# EAGLE design Mainboard (EAGLE 6.6.0)

## Sheet 1 of 3: Avionics
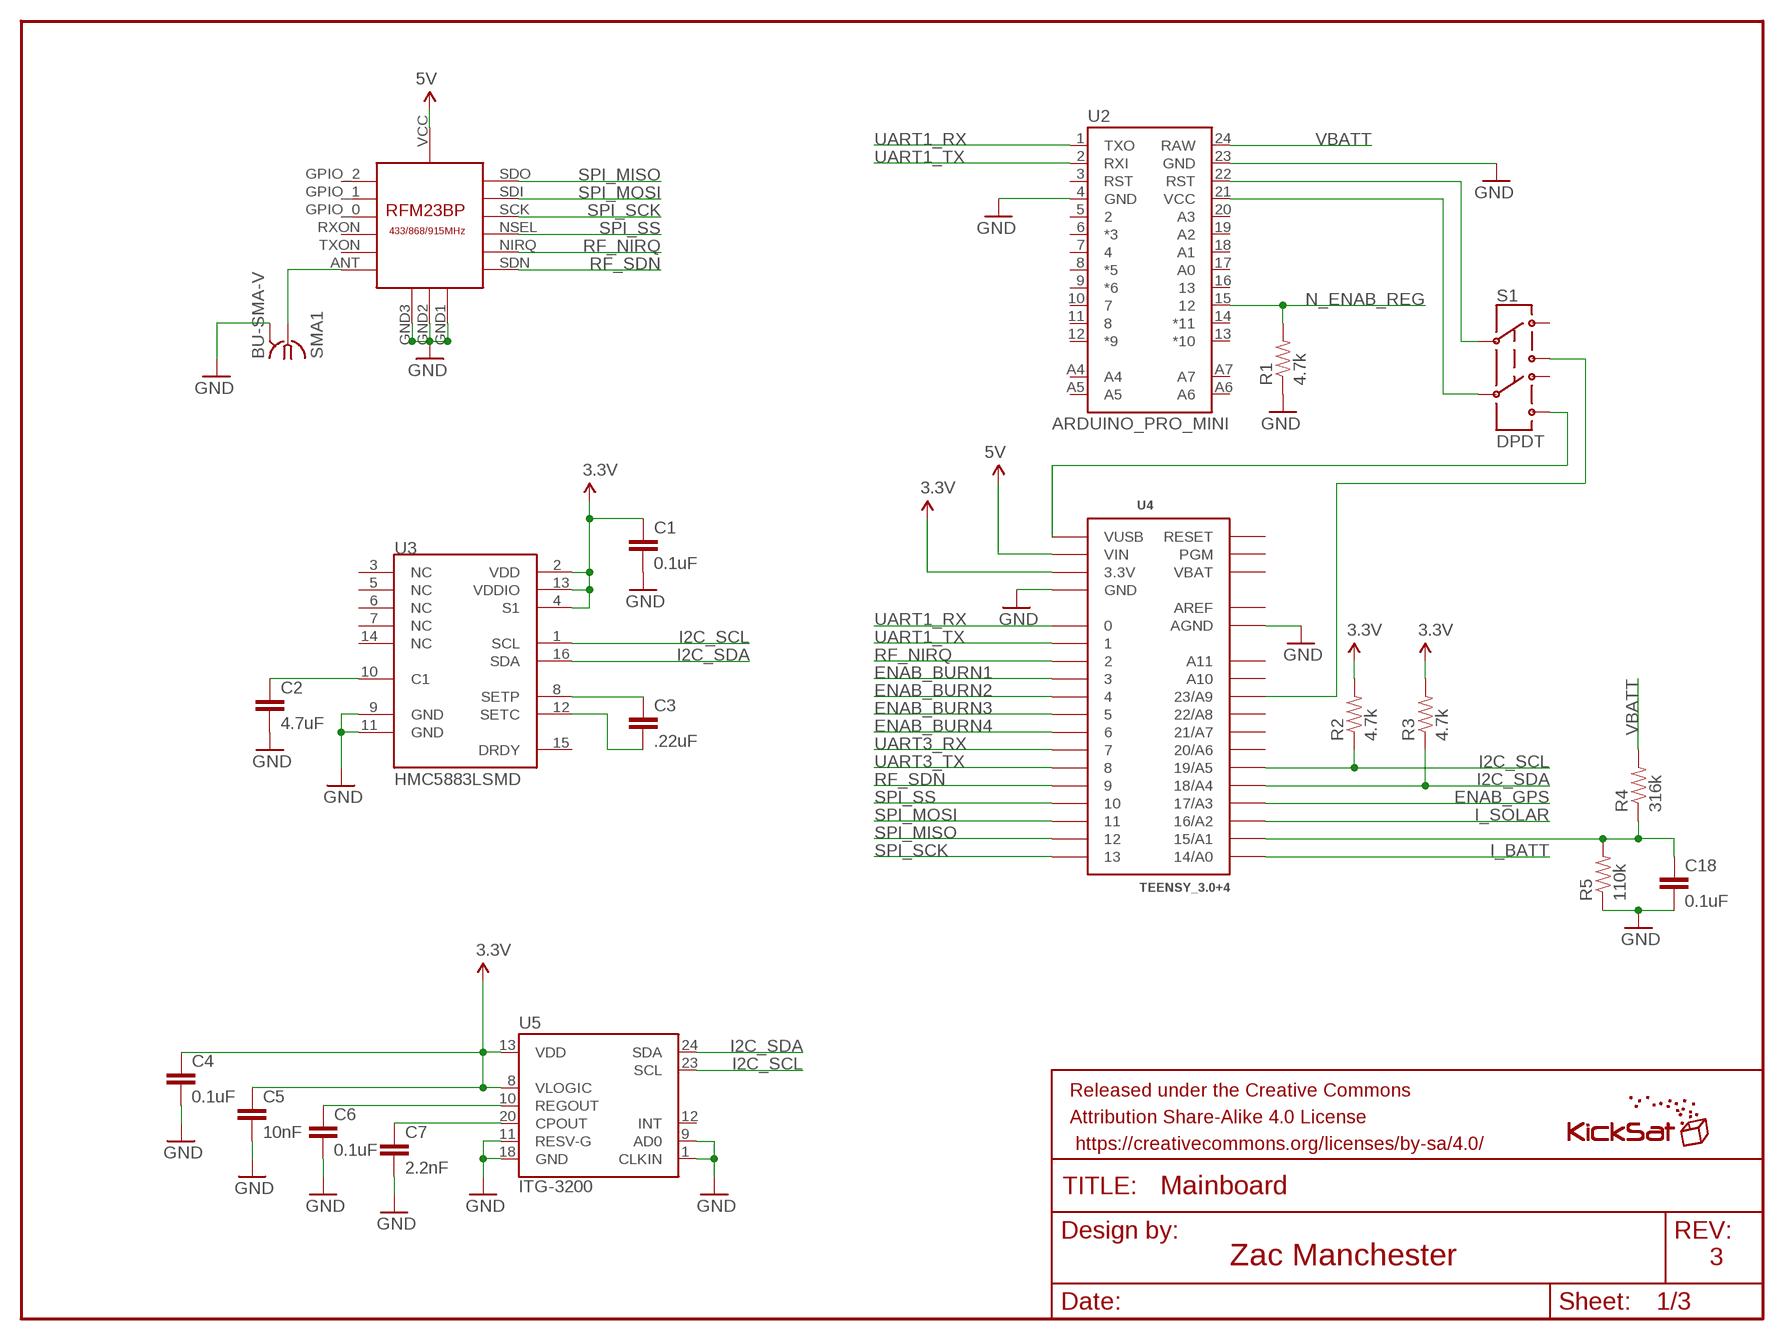
[diagram p0: schematic, sheet 1]

### Parts
C1  0.1uF  CAP0805  [0805]
C2  4.7uF  CAP0805  [0805]
C3  .22uF  CAP0805  [0805]
C4  0.1uF  CAP0805  [0805]
C5  10nF  CAP0805  [0805]
C6  0.1uF  CAP0805  [0805]
C7  2.2nF  CAP0805  [0805]
C18  0.1uF  CAP0805  [0805]
FRAME1  FRAME-LETTER  [CREATIVE_COMMONS]
R1  4.7k  RESISTOR0805-RES  [0805]
R2  4.7k  RESISTOR0805-RES  [0805]
R3  4.7k  RESISTOR0805-RES  [0805]
R4  316k  RESISTOR0805-RES  [0805]
R5  110k  RESISTOR0805-RES  [0805]
S1  DPDT  SWITCH-DPDTAYZ0202  [AYZ0202]
SMA1  BU-SMA-V  [BU-SMA-V]
U1  RFM23BP  [RFM23BP]
U2  ARDUINO_PRO_MINI  [ARDUINO_PRO_MINI]
U3  HMC5883LSMD  [16LPCC]
U4  TEENSY_3.0+4  [TEENSY_3.0+4]
U5  ITG-3200  [QFN-24]
U$3  KICKSAT_LOGO  [KICKSAT_LOGO]

### Nets
3.3V: C1.1 C4.1 C5.1 R2.2 R3.2 U3.2(VDD) U3.4(S1) U3.13(VDDIO) U4.3.3V U4.3.3V1(3.3V) U5.8(VLOGIC) U5.13(VDD) ; also sheet 2
5V: U1.VCC U4.VIN ; also sheet 2
ENAB_BURN1: U4.3 ; also sheet 2
ENAB_BURN2: U4.4 ; also sheet 2
ENAB_BURN3: U4.5 ; also sheet 2
ENAB_BURN4: U4.6 ; also sheet 2
ENAB_GPS: U4.17/A3 ; also sheet 2
GND: C1.2 C2.2 C4.2 C5.2 C6.2 C7.2 C18.2 R1.1 R5.1 SMA1.2 SMA1.3 SMA1.4 SMA1.5 U1.GND1 U1.GND2 U1.GND3 U2.4(GND) U2.23(GND) U3.9(GND) U3.11(GND) U4.AGND U4.GND U4.GND1(GND) U5.1(CLKIN) U5.9(AD0) U5.11(RESV-G) U5.18(GND) ; also sheet 2,3
I2C_SCL: R2.1 U3.1(SCL) U4.19/A5 U5.23(SCL)
I2C_SDA: R3.1 U3.16(SDA) U4.18/A4 U5.24(SDA)
I_BATT: U4.14/A0 ; also sheet 2
I_SOLAR: U4.16/A2 ; also sheet 2
N$11: S1.3 U4.23/A9
N$13: S1.6 U4.VUSB
N$19: SMA1.1 U1.ANT
N$37: C18.1 R4.1 R5.2 U4.15/A1
N$39: C7.1 U5.20(CPOUT)
N$40: C6.1 U5.10(REGOUT)
N$42: C2.1 U3.10(C1)
N$43: C3.1 U3.8(SETP)
N$44: C3.2 U3.12(SETC)
N_ENAB_REG: R1.2 U2.15 ; also sheet 2
PGM_RST: S1.2 U2.22(RST)
PGM_VCC: S1.5 U2.21(VCC)
RF_NIRQ: U1.NIRQ U4.2
RF_SDN: U1.SDN U4.9
SPI_MISO: U1.SDO U4.12
SPI_MOSI: U1.SDI U4.11
SPI_SCK: U1.SCK U4.13
SPI_SS: U1.NSEL U4.10
UART1_RX: U2.1(TXO) U4.0
UART1_TX: U2.2(RXI) U4.1
UART3_RX: U4.7 ; also sheet 3
UART3_TX: U4.8 ; also sheet 3
VBATT: R4.2 U2.24(RAW) ; also sheet 2,3
Unconnected: S1.1 S1.4 U1.GPIO_0 U1.GPIO_1 U1.GPIO_2 U1.RXON U1.TXON U2.3(RST) U2.5 U2.6(*3) U2.7 U2.8(*5) U2.9(*6) U2.10 U2.11 U2.12(*9) U2.13(*10) U2.14(*11) U2.16 U2.17(A0) U2.18(A1) U2.19(A2) U2.20(A3) U2.A4 U2.A5 U2.A6 U2.A7 U3.3(NC) U3.5(NC) U3.6(NC) U3.7(NC) U3.14(NC) U3.15(DRDY) U4.20/A6 U4.21/A7 U4.22/A8 U4.A10 U4.A11 U4.PGM U4.RESET U5.12(INT)

### Notes on the sheet
- Zac Manchester | 3

## Sheet 2 of 3: Power
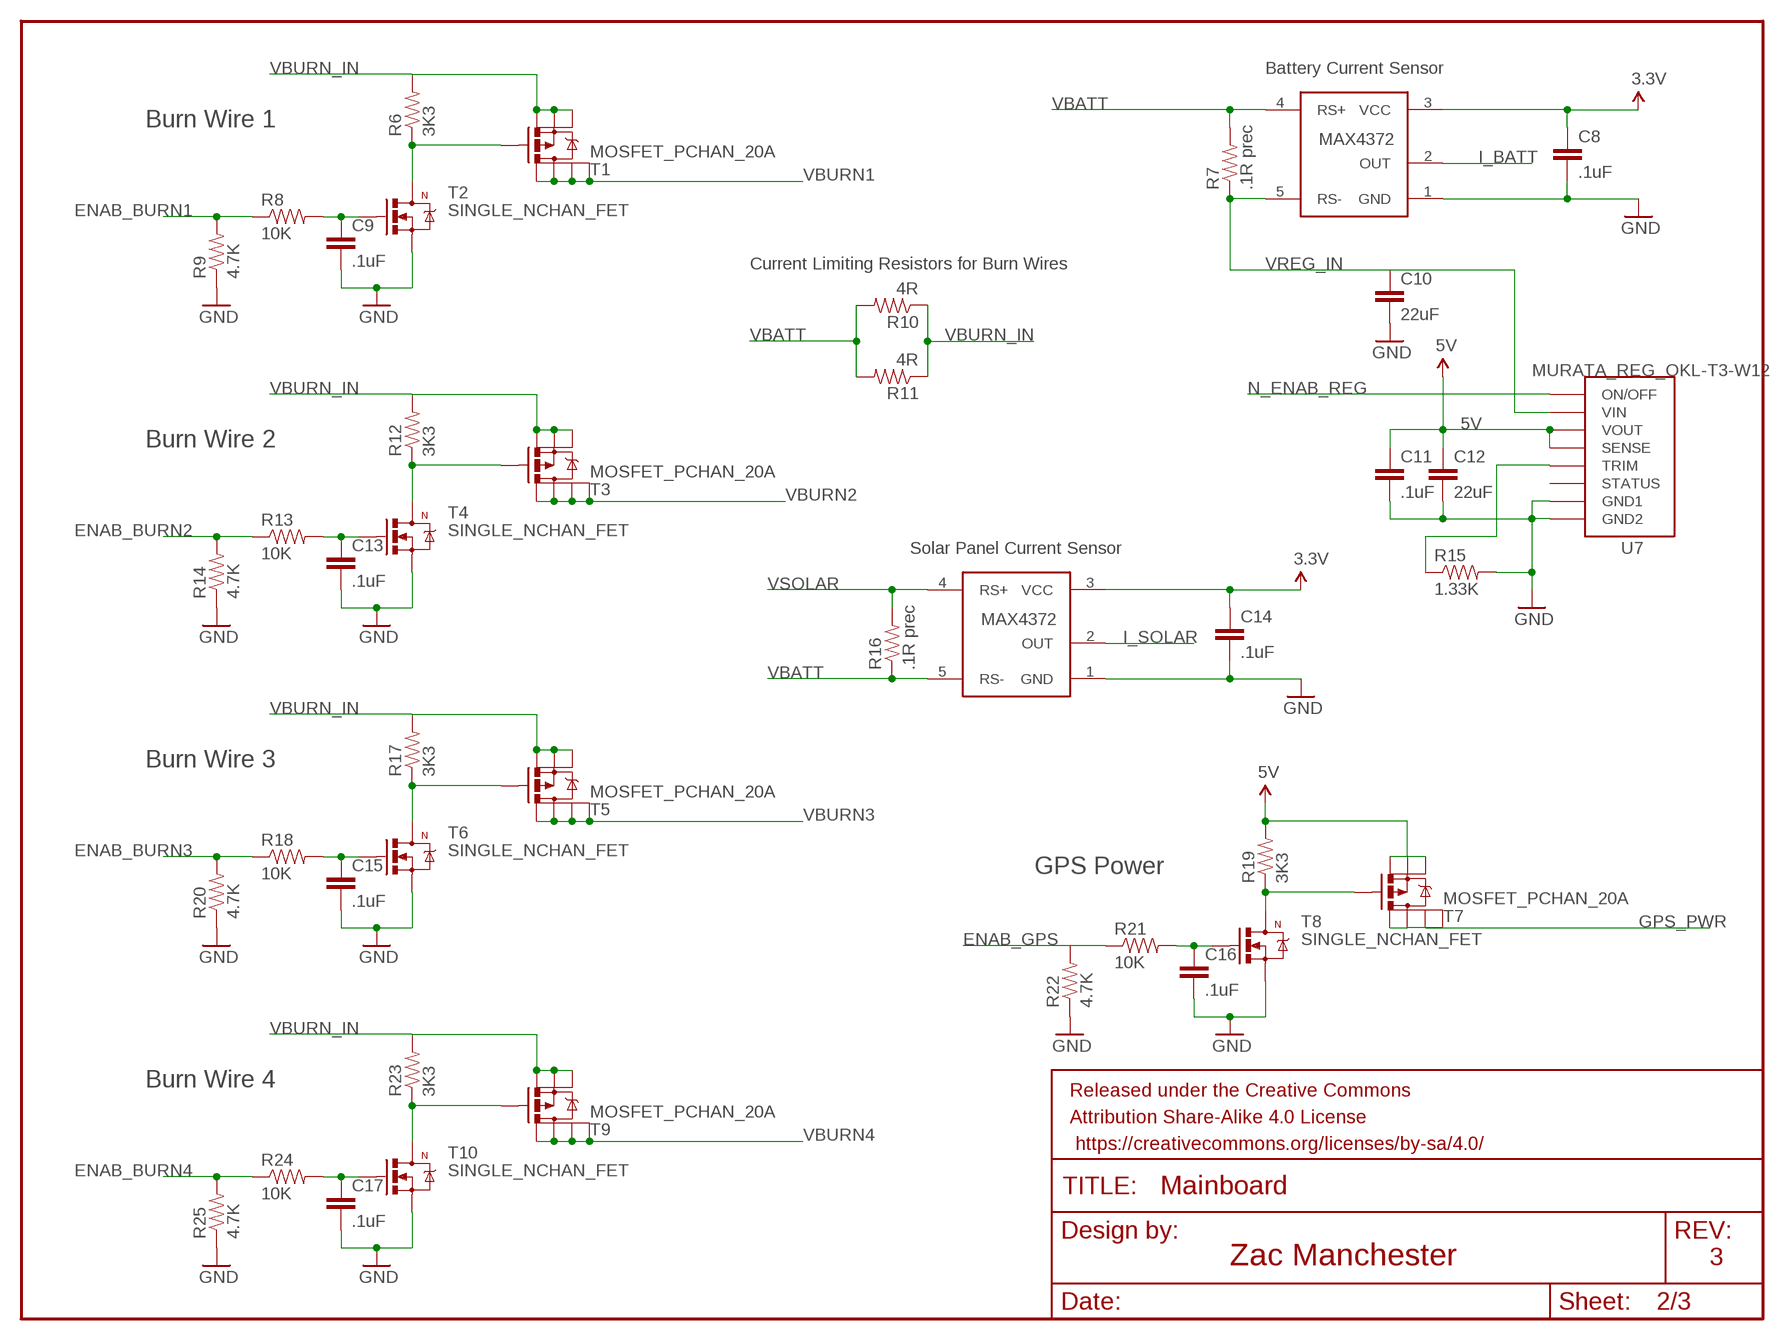
[diagram p1: schematic, sheet 2]

### Parts
C8  .1uF  CAP0805  [0805]
C9  .1uF  CAP0805  [0805]
C10  22uF  CAP1206  [1206]
C11  .1uF  CAP0805  [0805]
C12  22uF  CAP1206  [1206]
C13  .1uF  CAP0805  [0805]
C14  .1uF  CAP0805  [0805]
C15  .1uF  CAP0805  [0805]
C16  .1uF  CAP0805  [0805]
C17  .1uF  CAP0805  [0805]
FRAME2  FRAME-LETTER  [CREATIVE_COMMONS]
R6  3K3  RESISTOR0805-RES  [0805]
R7  .1R prec  RESISTOR0805-RES  [0805]
R8  10K  RESISTOR0805-RES  [0805]
R9  4.7K  RESISTOR0805-RES  [0805]
R10  4R  RESISTOR2512  [R2512]
R11  4R  RESISTOR2512  [R2512]
R12  3K3  RESISTOR0805-RES  [0805]
R13  10K  RESISTOR0805-RES  [0805]
R14  4.7K  RESISTOR0805-RES  [0805]
R15  1.33K  RESISTOR0805-RES  [0805]
R16  .1R prec  RESISTOR0805-RES  [0805]
R17  3K3  RESISTOR0805-RES  [0805]
R18  10K  RESISTOR0805-RES  [0805]
R19  3K3  RESISTOR0805-RES  [0805]
R20  4.7K  RESISTOR0805-RES  [0805]
R21  10K  RESISTOR0805-RES  [0805]
R22  4.7K  RESISTOR0805-RES  [0805]
R23  3K3  RESISTOR0805-RES  [0805]
R24  10K  RESISTOR0805-RES  [0805]
R25  4.7K  RESISTOR0805-RES  [0805]
T1  MOSFET_PCHAN_20A  [SO8]
T2  SINGLE_NCHAN_FET  [SOT23-3]
T3  MOSFET_PCHAN_20A  [SO8]
T4  SINGLE_NCHAN_FET  [SOT23-3]
T5  MOSFET_PCHAN_20A  [SO8]
T6  SINGLE_NCHAN_FET  [SOT23-3]
T7  MOSFET_PCHAN_20A  [SO8]
T8  SINGLE_NCHAN_FET  [SOT23-3]
T9  MOSFET_PCHAN_20A  [SO8]
T10  SINGLE_NCHAN_FET  [SOT23-3]
U6  CURRENT_MAX4372  [SOT23-5]
U7  MURATA_REG_OKL-T3-W12  MURATA_REG_OKL-T6-W12  [MURATA_REG_OKL-T6-W12]
U8  CURRENT_MAX4372  [SOT23-5]

### Nets
3.3V: C8.1 C14.1 U6.3(VCC) U8.3(VCC) ; also sheet 1
5V: C11.1 C12.1 R19.2 T7.1(S) T7.2(S) T7.3(S) U7.4(VOUT) U7.5(SENSE) ; also sheet 1
ENAB_BURN1: R8.1 R9.2 ; also sheet 1
ENAB_BURN2: R13.1 R14.2 ; also sheet 1
ENAB_BURN3: R18.1 R20.2 ; also sheet 1
ENAB_BURN4: R24.1 R25.2 ; also sheet 1
ENAB_GPS: R21.1 R22.2 ; also sheet 1
GND: C8.2 C9.2 C10.2 C11.2 C12.2 C13.2 C14.2 C15.2 C16.2 C17.2 R9.1 R14.1 R15.2 R20.1 R22.1 R25.1 T2.2(S) T4.2(S) T6.2(S) T8.2(S) T10.2(S) U6.1(GND) U7.3(GND1) U7.7(GND2) U8.1(GND) ; also sheet 1,3
GPS_PWR: T7.5(D) T7.6(D) T7.7(D) T7.8(D) ; also sheet 3
I_BATT: U6.2(OUT) ; also sheet 1
I_SOLAR: U8.2(OUT) ; also sheet 1
N$2: C13.1 R13.2 T4.1(G)
N$3: R12.1 T3.4(G) T4.3(D)
N$5: C15.1 R18.2 T6.1(G)
N$6: R17.1 T5.4(G) T6.3(D)
N$7: R15.1 U7.6(TRIM)
N$8: C17.1 R24.2 T10.1(G)
N$9: R23.1 T9.4(G) T10.3(D)
N$10: C16.1 R21.2 T8.1(G)
N$12: R19.1 T7.4(G) T8.3(D)
N$21: C9.1 R8.2 T2.1(G)
N$24: R6.1 T1.4(G) T2.3(D)
N_ENAB_REG: U7.1(ON/OFF) ; also sheet 1
VBATT: R7.2 R10.2 R11.2 R16.1 U6.4(RS+) U8.5(RS-) ; also sheet 1,3
VBURN1: T1.5(D) T1.6(D) T1.7(D) T1.8(D) ; also sheet 3
VBURN2: T3.5(D) T3.6(D) T3.7(D) T3.8(D) ; also sheet 3
VBURN3: T5.5(D) T5.6(D) T5.7(D) T5.8(D) ; also sheet 3
VBURN4: T9.5(D) T9.6(D) T9.7(D) T9.8(D) ; also sheet 3
VBURN_IN: R6.2 R10.1 R11.1 R12.2 R17.2 R23.2 T1.1(S) T1.2(S) T1.3(S) T3.1(S) T3.2(S) T3.3(S) T5.1(S) T5.2(S) T5.3(S) T9.1(S) T9.2(S) T9.3(S)
VREG_IN: C10.1 R7.1 U6.5(RS-) U7.2(VIN)
VSOLAR: R16.2 U8.4(RS+) ; also sheet 3
Unconnected: U7.10(STATUS)

### Notes on the sheet
- Battery Current Sensor
- Burn Wire 1
- Current Limiting Resistors for Burn Wires
- Burn Wire 2
- Solar Panel Current Sensor
- Burn Wire 3
- GPS Power
- Burn Wire 4
- Zac Manchester | 3

## Sheet 3 of 3: Connectors
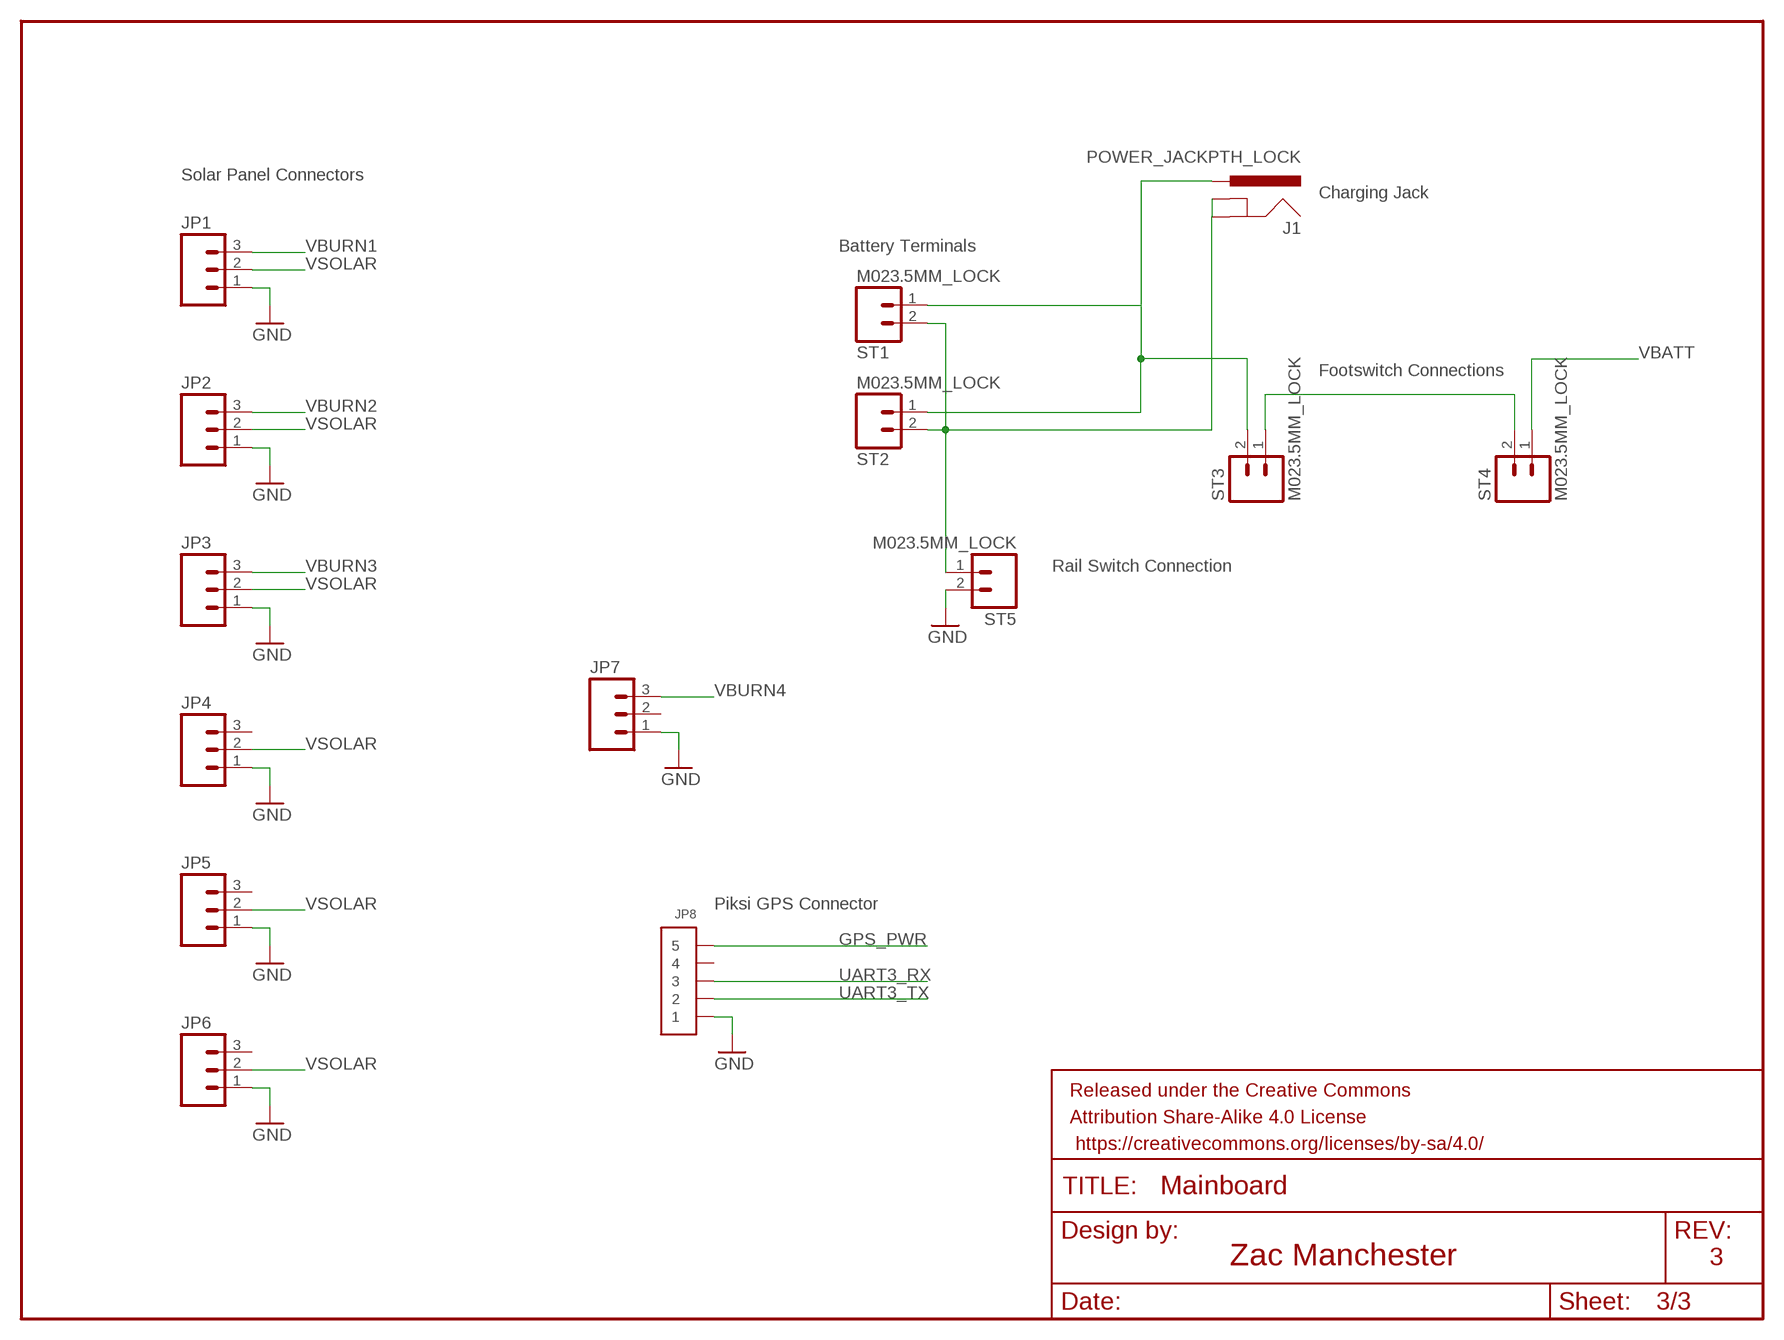
[diagram p2: schematic, sheet 3]

### Parts
FRAME3  FRAME-LETTER  [CREATIVE_COMMONS]
J1  POWER_JACKPTH_LOCK  [POWER_JACK_PTH_LOCK]
JP1  M03POLAR_LOCK  [MOLEX-1X3_LOCK]
JP2  M03POLAR_LOCK  [MOLEX-1X3_LOCK]
JP3  M03POLAR_LOCK  [MOLEX-1X3_LOCK]
JP4  M03POLAR_LOCK  [MOLEX-1X3_LOCK]
JP5  M03POLAR_LOCK  [MOLEX-1X3_LOCK]
JP6  M03POLAR_LOCK  [MOLEX-1X3_LOCK]
JP7  M03POLAR_LOCK  [MOLEX-1X3_LOCK]
JP8  CONN_5-1-53261  [PB-53261-05]
ST1  M023.5MM_LOCK  [SCREWTERMINAL-3.5MM-2_LOCK]
ST2  M023.5MM_LOCK  [SCREWTERMINAL-3.5MM-2_LOCK]
ST3  M023.5MM_LOCK  [SCREWTERMINAL-3.5MM-2_LOCK]
ST4  M023.5MM_LOCK  [SCREWTERMINAL-3.5MM-2_LOCK]
ST5  M023.5MM_LOCK  [SCREWTERMINAL-3.5MM-2_LOCK]

### Nets
BATT_INPUT: J1.PWR ST1.1 ST2.1 ST3.2
GND: JP1.1 JP2.1 JP3.1 JP4.1 JP5.1 JP6.1 JP7.1 JP8.1 ST5.2 ; also sheet 1,2
GPS_PWR: JP8.5 ; also sheet 2
N$1: J1.GND J1.GNDBREAK ST1.2 ST2.2 ST5.1
N$4: ST3.1 ST4.2
UART3_RX: JP8.3 ; also sheet 1
UART3_TX: JP8.2 ; also sheet 1
VBATT: ST4.1 ; also sheet 1,2
VBURN1: JP1.3 ; also sheet 2
VBURN2: JP2.3 ; also sheet 2
VBURN3: JP3.3 ; also sheet 2
VBURN4: JP7.3 ; also sheet 2
VSOLAR: JP1.2 JP2.2 JP3.2 JP4.2 JP5.2 JP6.2 ; also sheet 2
Unconnected: JP4.3 JP5.3 JP6.3 JP7.2 JP8.4

### Notes on the sheet
- Solar Panel Connectors
- Charging Jack
- Battery Terminals
- Footswitch Connections
- Rail Switch Connection
- Piksi GPS Connector
- Zac Manchester | 3

## Power pins joined to a net without a drawn wire
AREF: U4.AREF
VBAT: U4.VBAT

## Library data of the parts
C1-C18 = SparkFun-Capacitors:CAP: Capacitor Standard 0603 ceramic capacitor, and 0.1" leaded capacitor.
FRAME1-FRAME3 = SparkFun-Aesthetics:FRAME-LETTER: Schematic Frame Standard 8.5x11 US Letter frame
J1 = SparkFun-Connectors:POWER_JACK: Power Jack This is the standard 5.5mm barrel jack for power. The PTH is the most common, proven, reliable, footprint. The Slot footprint only works if the mill layer is transmitted to the PCB fab house so be warned. Mating wall wart : TOL-00298 (and others); PROD_ID: PRT-00119
JP1-JP7 = SparkFun-Connectors:M03: Header 3 Standard 3-pin 0.1" header. Use with straight break away headers (SKU : PRT-00116), right angle break away headers (PRT-00553), swiss pins (PRT-00743), machine pins (PRT-00117), and female headers (PRT-00115). Molex polarized connector foot print use with SKU : PRT-08232 with associated crimp pins and housings.
JP8 = pel_molex:CONN_5-1
R1-R25 = SparkFun-Resistors:RESISTOR: Resistor Basic schematic elements and footprints for 0603, 1206, and PTH resistors.
S1 = SparkFun-Electromechanical:SWITCH-DPDT: DPDT Version of the COM-00597; PROD_ID: SWCH-08179
SMA1 = con-coax:BU-SMA-V: FEMALE SMA CONNECTOR Radiall distributor RS 112-3794; OC_FARNELL: unknown; OC_NEWARK: unknown
ST1-ST5 = SparkFun-Connectors:M02: Standard 2-pin 0.1" header. Use with - straight break away headers ( PRT-00116) - right angle break away headers (PRT-00553) - swiss pins (PRT-00743) - machine pins (PRT-00117) - female headers (PRT-00115) Molex polarized connector foot print use with: PRT-08233 with associated crimp pins and housings. 2.54_SCREWTERM for use with PRT-10571. 3.5mm Screw Terminal footprints for PRT-08084 5mm Screw Terminal footprints for use with PRT-08433
T1 T3 T5 T7 T9 = phonesat:MOSFET_PCHAN_20A
T2 T4 T6 T8 T10 = phonesat:SINGLE_NCHAN_FET
U1 = RFM23BP:RFM23BP: HopeRF RFM23BP Library by: http://projects.weber-itam.de
U2 = SparkFun-Boards:ARDUINO_PRO_MINI
U3 = SparkFun-Sensors:HMC5883L: 3 Axis Digital Compass IC
U4 = Teensy3.0:TEENSY_3.0+4: Teensy 3.0 board, showing all pins that are easily acessible. See 'AllAnalogPins" and 'AllPins' packages for additional pin holes, as needed. The 'Basic' package has fewer pins.
U5 = SparkFun-Sensors:ITG-3200: ITG-3200 3-axis gyro, digital output, qfn24 package
U6 U8 = phonesat:CURRENT_MAX4372
U7 = phonesat:MURATA_REG_OKL-T6-W12
U$3 = KickSat-Logo:KICKSAT_LOGO

## Board
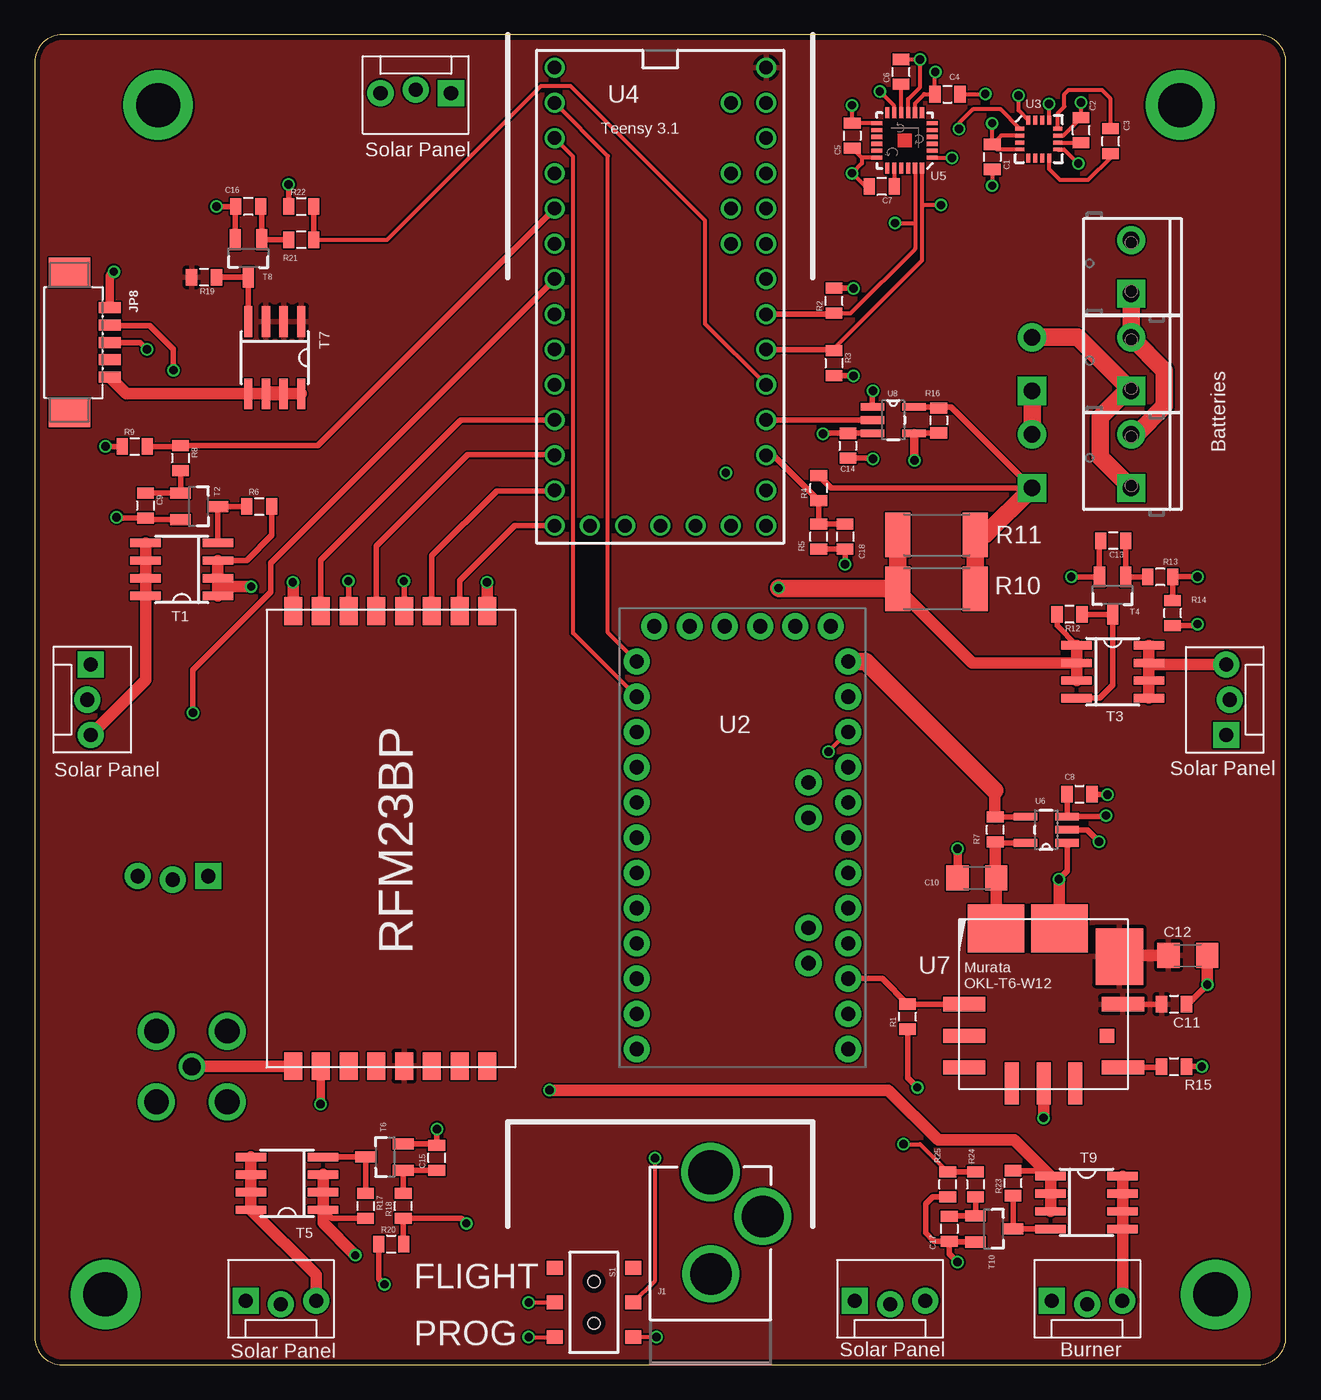
[diagram p3: board, top side]
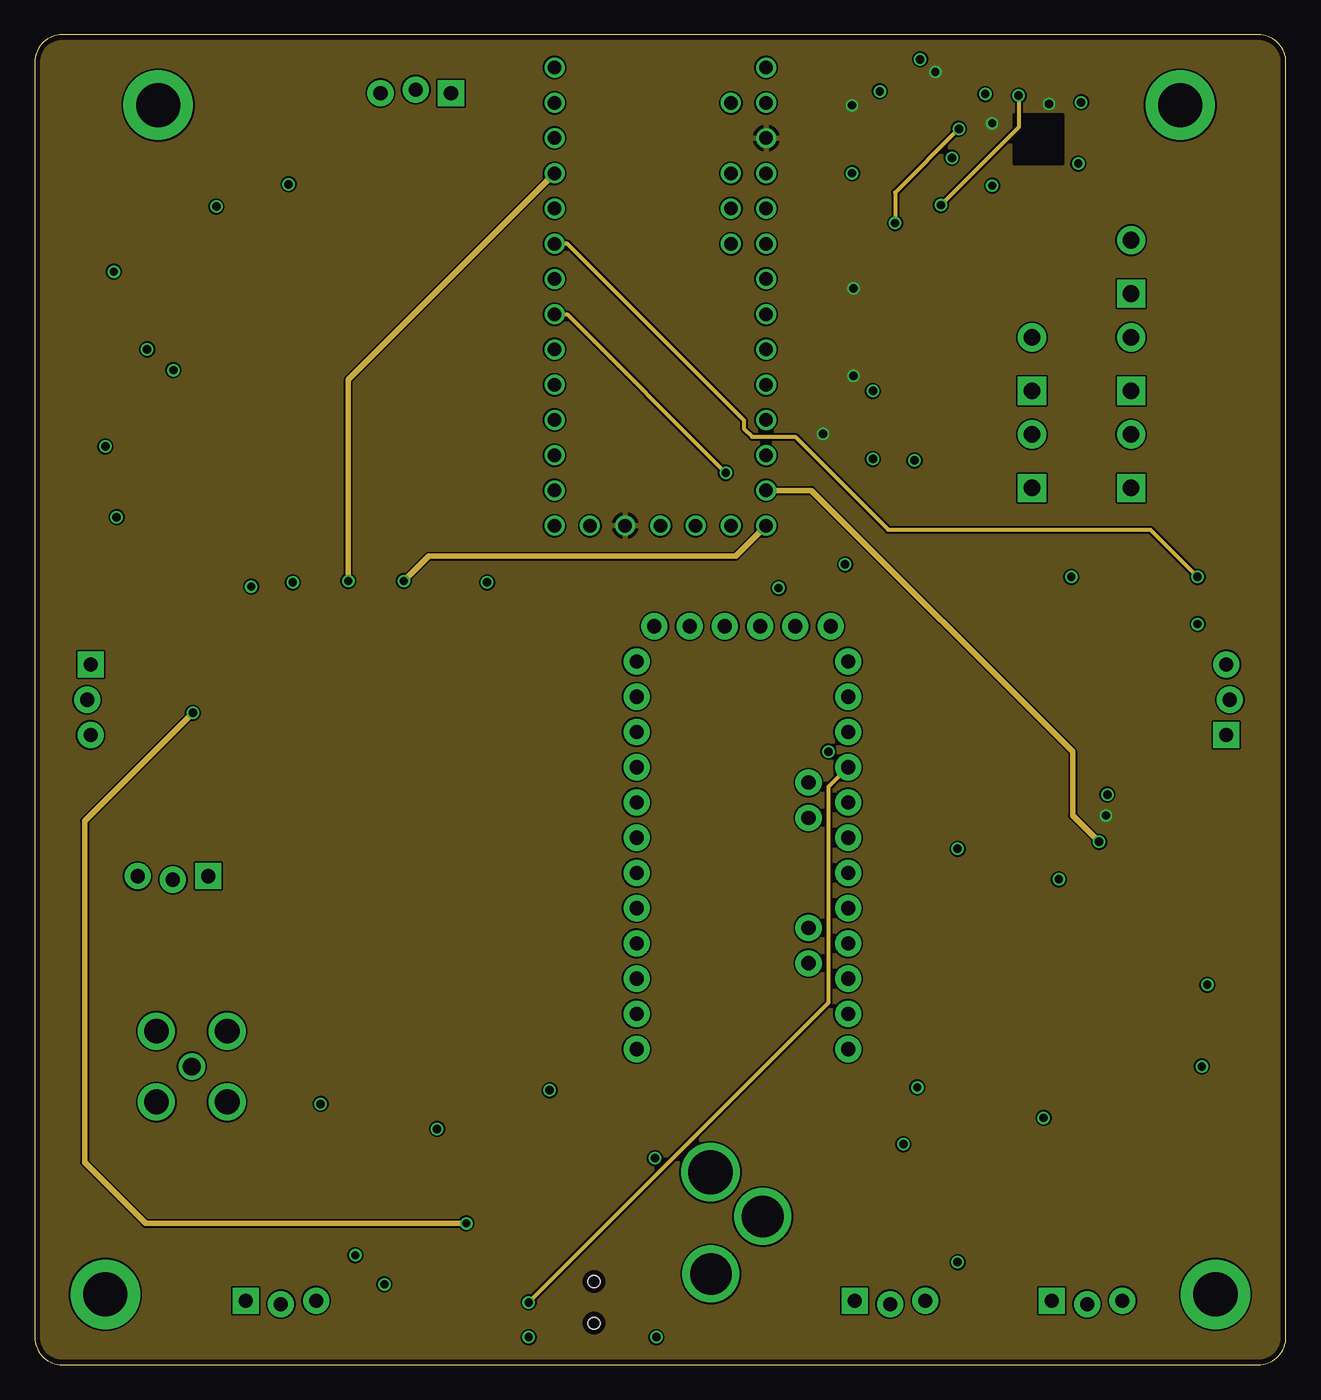
[diagram p4: board, inner layer Route2]
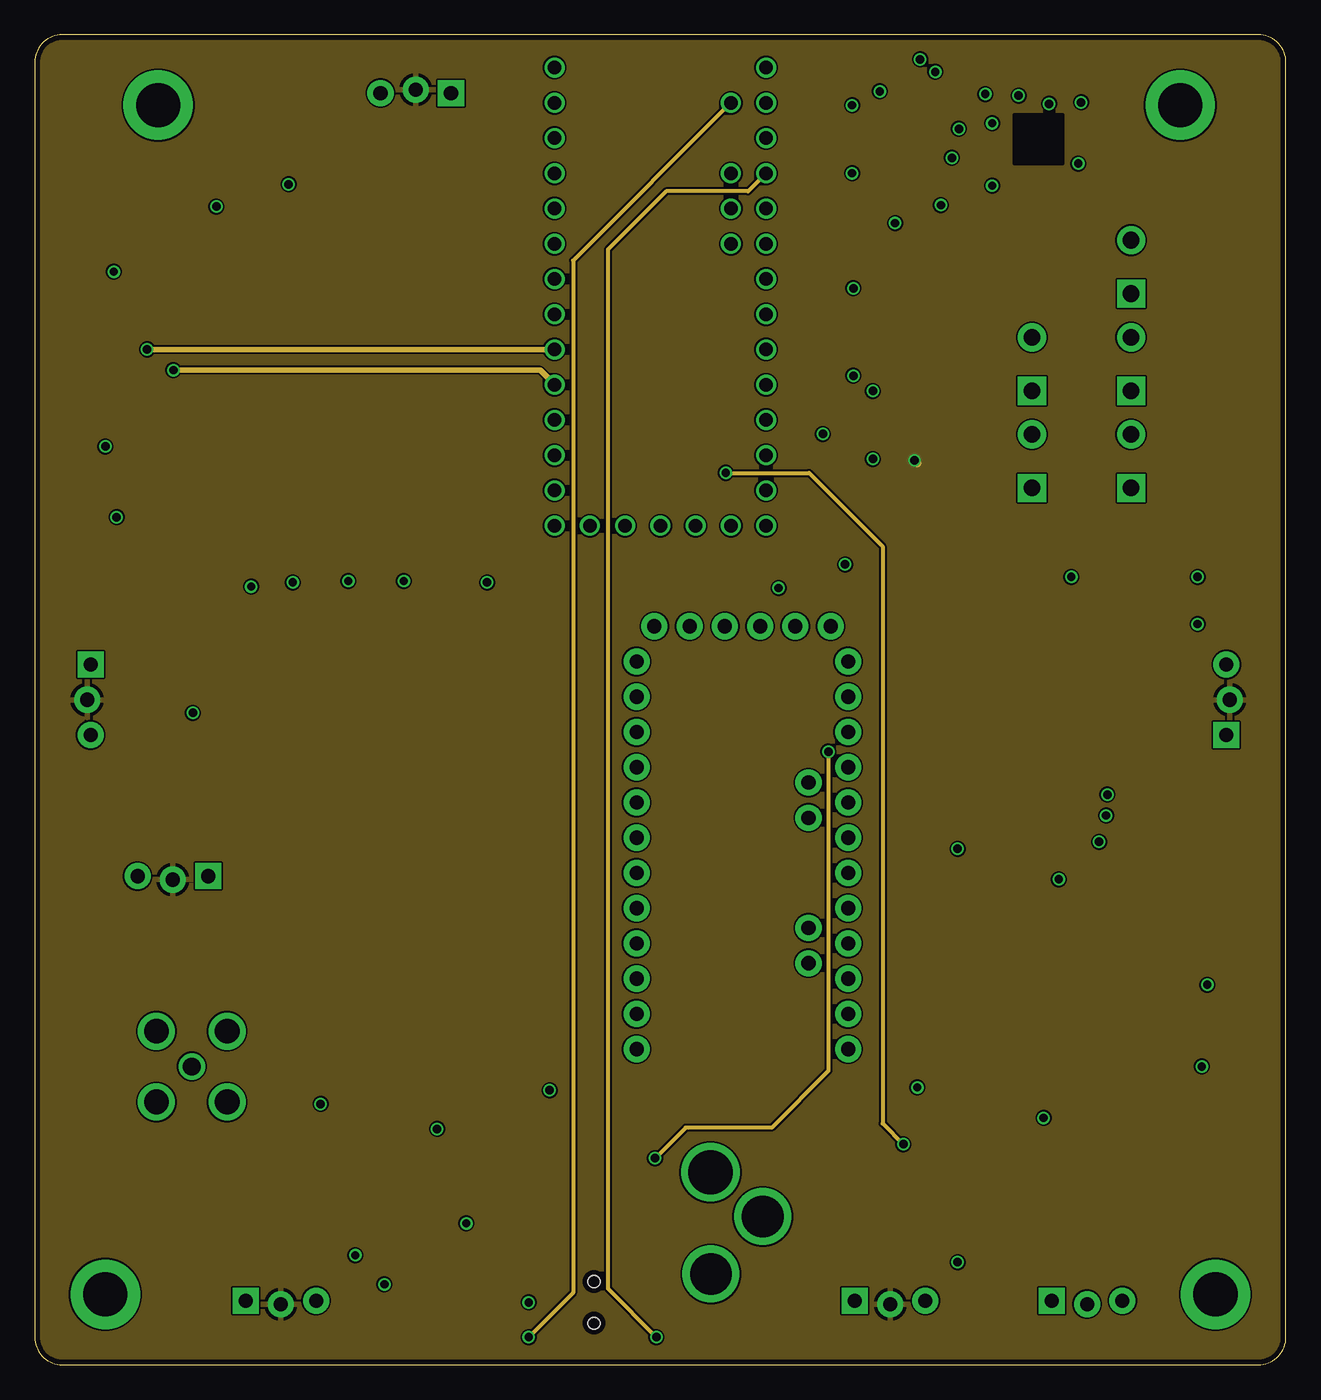
[diagram p5: board, inner layer Route15]
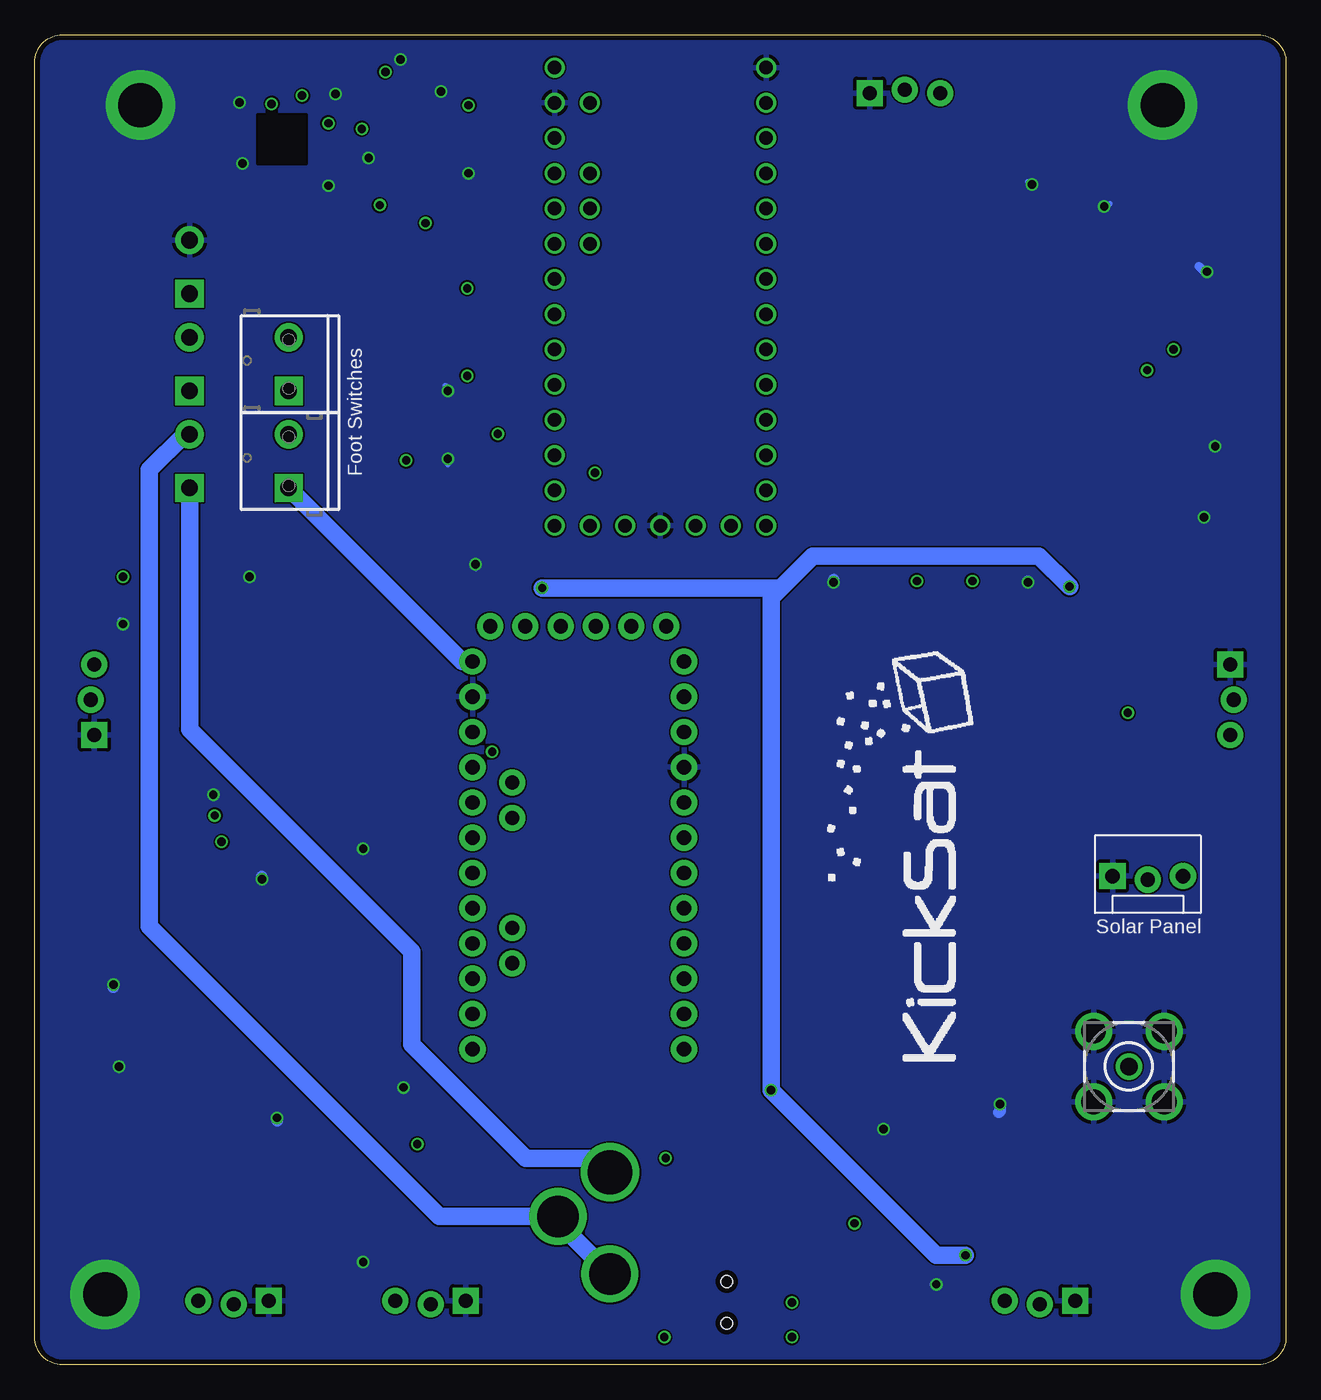
[diagram p6: board, bottom side, seen from below]

Size 90.17 x 95.89 mm. Coordinates in mm from the lower left corner, seen from the top.
Outline: 0,93.89 0,2 arc90 2,0 88.17,0 arc90 90.17,2 90.17,93.89 arc90 88.17,95.89 2,95.89 arc90 0,93.89
Copper layers (1*2*15*16): Top 0.035559375mm / dielectric 0.17018125mm / Route2 0.01778125mm / dielectric 47mil / Route15 0.01778125mm / dielectric 0.17018125mm / Bottom 0.035559375mm
Design rules "OSHPark-4layer": minimum track width 5mil, minimum drill 10mil, track to track 5mil, track to pad 5mil, pad to pad 5mil, via to via 5mil, smd to smd 5mil, copper to edge 15mil, drill to drill 6mil, minimum pad ring 4mil, minimum via ring 4mil, stop-mask expansion 4mil, vias tented up to drill 0mil, thermal gap 10mil

### Footprints (pad centres in the part's own frame; a part is rotated, then mirrored left to right if it is on the bottom)
0805 = smd 0.8 x 1.2: 1 -0.9,0; 2 0.9,0
1206 = smd 1.6 x 1.8: 1 -1.4,0; 2 1.4,0
POWER_JACK_PTH_LOCK = drill 2.997 pad 4.115: GND 0.025,6.557; GNDBREAK 3.762,10.7 | drill 3.2 pad 4.115: PWR 0,13.878
MOLEX-1X3_LOCK = drill 1.016 pad 1.88 square: 1 0,0.127 | drill 1.016 pad 1.88: 2 2.54,-0.127; 3 5.08,0.127
PB-53261-05 = smd 0.8 x 1.6: 1 -2.5,1.1; 2 -1.25,1.1; 3 0,1.1; 4 1.25,1.1; 5 2.5,1.1 | smd 2.1 x 3: MNT1 -5.05,-1.8; MNT2 5.05,-1.8
R2512 = smd 1.8 x 3.2: 1 -2.8,0; 2 2.8,0
AYZ0202 = smd 1 x 1.15: 1 -2.5,2.825; 2 0,2.825; 3 2.5,2.825; 4 -2.5,-2.825; 5 0,-2.825; 6 2.5,-2.825 | hole 0.85: 1.5,0; -1.5,0
BU-SMA-V = drill 1.27: 1 0,0 | drill 1.778: 2 -2.55,2.55; 3 2.55,2.55; 4 2.55,-2.55; 5 -2.55,-2.55
SCREWTERMINAL-3.5MM-2_LOCK = drill 1.2 pad 2.032 square: 1 -0.178,0 | drill 1.2 pad 2.032: 2 3.678,0
SO8 = smd 0.6 x 2.2: 1 -1.905,-2.6; 2 -0.635,-2.6; 3 0.635,-2.6; 4 1.905,-2.6; 5 1.905,2.6; 6 0.635,2.6; 7 -0.635,2.6; 8 -1.905,2.6
SOT23-3 = smd 0.8 x 1.5: 1 -0.95,-1.3; 2 0.95,-1.3; 3 0,1.4
RFM23BP = smd 2 x 1.3: ANT 16.9,-7.5; GND1 -15.9,6.5; GND2 -15.9,-7.5; GND3 16.9,-5.5; GPIO_0 16.9,2.5; GPIO_1 16.9,4.5; GPIO_2 16.9,6.5; NIRQ -15.9,-3.5; NSEL -15.9,-1.5; RXON 16.9,-1.5; SCK -15.9,0.5; SDI -15.9,2.5; SDN -15.9,-5.5; SDO -15.9,4.5; TXON 16.9,-3.5; VCC 16.9,0.5
ARDUINO_PRO_MINI = drill 1.016 pad 1.88: 1 -7.62,12.7; 2 -7.62,10.16; 3 -7.62,7.62; 4 -7.62,5.08; 5 -7.62,2.54; 6 -7.62,0; 7 -7.62,-2.54; 8 -7.62,-5.08; 9 -7.62,-7.62; 10 -7.62,-10.16; 11 -7.62,-12.7; 12 -7.62,-15.24; 13 7.62,-15.24; 14 7.62,-12.7; 15 7.62,-10.16; 16 7.62,-7.62; 17 7.62,-5.08; 18 7.62,-2.54; 19 7.62,0; 20 7.62,2.54; 21 7.62,5.08; 22 7.62,7.62; 23 7.62,10.16; 24 7.62,12.7; A4 4.763,1.429; A5 4.763,3.969; A6 4.763,-9.049; A7 4.763,-6.509; BLK -6.35,15.24; GND -3.81,15.24; GRN 6.35,15.24; RXI 1.27,15.24; TXO 3.81,15.24; VCC -1.27,15.24
16LPCC = smd 0.65 x 0.28: 1 -1.37,0.75; 2 -1.37,0.25; 3 -1.37,-0.25; 4 -1.37,-0.75; 9 1.37,-0.75; 10 1.37,-0.25; 11 1.37,0.25; 12 1.37,0.75 | smd 0.28 x 0.65: 5 -0.75,-1.37; 6 -0.25,-1.37; 7 0.25,-1.37; 8 0.75,-1.37; 13 0.75,1.37; 14 0.25,1.37; 15 -0.25,1.37; 16 -0.75,1.37
TEENSY_3.0+4 = drill 0.965: 0 -7.62,13.97; 1 -7.62,11.43; 2 -7.62,8.89; 3 -7.62,6.35; 3.3V 7.62,11.43; 3.3V1 -2.54,-16.51; 4 -7.62,3.81; 5 -7.62,1.27; 6 -7.62,-1.27; 7 -7.62,-3.81; 8 -7.62,-6.35; 9 -7.62,-8.89; 10 -7.62,-11.43; 11 -7.62,-13.97; 12 -7.62,-16.51; 13 7.62,-16.51; 14/A0 7.62,-13.97; 15/A1 7.62,-11.43; 16/A2 7.62,-8.89; 17/A3 7.62,-6.35; 18/A4 7.62,-3.81; 19/A5 7.62,-1.27; 20/A6 7.62,1.27; 21/A7 7.62,3.81; 22/A8 7.62,6.35; 23/A9 7.62,8.89; A10 5.08,6.35; A11 5.08,3.81; AGND 7.62,13.97; AREF 5.08,8.89; GND -7.62,16.51; GND1 0,-16.51; PGM 2.54,-16.51; RESET 5.08,-16.51; VBAT -5.08,-16.51; VIN 7.62,16.51; VUSB 5.08,13.97
QFN-24 = smd 0.8 x 0.3: 1 -2,1.25; 2 -2,0.75; 3 -2,0.25; 4 -2,-0.25; 5 -2,-0.75; 6 -2,-1.25; 13 2,-1.25; 14 2,-0.75; 15 2,-0.25; 16 2,0.25; 17 2,0.75; 18 2,1.25 | smd 0.3 x 0.8: 7 -1.25,-2; 8 -0.75,-2; 9 -0.25,-2; 10 0.25,-2; 11 0.75,-2; 12 1.25,-2; 19 1.25,2; 20 0.75,2; 21 0.25,2; 22 -0.25,2; 23 -0.75,2; 24 -1.25,2
SOT23-5 = smd 0.55 x 1.7: 1 -0.95,-1.5; 2 0,-1.5; 3 0.95,-1.5; 4 0.95,1.5; 5 -0.95,1.5
MURATA_REG_OKL-T6-W12 = smd 3.048 x 1.016: 1 -5.715,0; 5 5.715,0; 6 5.715,-4.572; 9 -5.715,-4.572; 10 -5.715,-2.286 | smd 4.064 x 3.429: 2 -3.429,5.461; 3 1.143,5.461 | smd 3.429 x 4.064: 4 5.461,3.429 | smd 1.016 x 3.048: 7 0,-5.715; 8 -2.286,-5.715; 12 2.286,-5.715 | smd 1.016 x 1.016: 11 4.572,-2.286

### Placement (x,y rotation side)
C1  69,87.07 270 top
C2  75.41,89.01 90 top
C3  77.53,88.21 90 top
C4  65.78,91.59 0 top
C5  58.91,88.61 270 top
C6  62.43,93.2 90 top
C7  61.04,84.95 180 top
C8  75.29,41.13 0 top
C9  7.99,61.94 270 top
C10  67.9,35.1 180 top
C11  82.1,26 0 top
C12  83.1,29.5 0 top
C13  77.72,59.41 180 top
C14  58.6,66.25 270 top
C15  28.97,14.93 90 top
C16  15.4,83.5 180 top
C17  65.9,9.8 270 top
C18  58.4,59.7 270 top
FRAME1  -9,23.6 0 top  (outside the outline)
FRAME2  -9,15.1 0 top  (outside the outline)
FRAME3  -9,6.6 0 top  (outside the outline)
J1  48.7,0 0 top
JP1  3.9,50.48 270 top
JP2  86,45.4 90 top
JP3  15.2,4.5 0 top
JP4  12.5,35.1 0 bottom
JP5  59.1,4.5 0 top
JP6  30,91.8 180 top
JP7  73.3,4.5 0 top
JP8  4.3,73.7 270 top
R1  62.9,25.1 90 top
R2  57.6,76.7 90 top
R3  57.6,72.2 270 top
R4  56.5,63.2 90 top
R5  56.5,59.7 90 top
R6  16.17,61.88 0 top
R7  69.22,38.58 90 top
R8  10.51,65.37 270 top
R9  7.2,66.2 0 top
R10  64.99,55.95 0 top
R11  64.99,59.82 0 top
R12  74.57,54.1 180 top
R13  81.11,56.8 180 top
R14  82,54.2 90 top
R15  82.1,21.5 0 top
R16  65.15,68.08 270 top
R17  23.85,11.45 270 top
R18  26.56,11.45 90 top
R19  12.2,78.4 180 top
R20  25.7,8.7 0 top
R21  19.2,81.1 180 top
R22  19.2,83.5 0 top
R23  70.5,13.1 90 top
R24  67.8,13 270 top
R25  65.8,13 90 top
S1  40.3,4.5 270 top
SMA1  11.32,21.5 180 bottom
ST1  79.01,70.39 90 top
ST2  79.01,63.39 90 top
ST3  71.87,70.39 90 bottom
ST4  71.87,63.39 90 bottom
ST5  79.01,77.4 90 top
T1  10.6,57.34 90 top
T2  11.81,61.88 270 top
T3  77.69,49.96 270 top
T4  77.68,55.5 180 top
T5  18.18,13.08 90 top
T6  25.26,14.98 90 top
T7  17.3,72.6 180 top
T8  15.4,79.8 180 top
T9  75.8,11.7 270 top
T10  69.1,9.8 270 top
U1  26.12,38.44 270 top
U2  51,38 0 top
U3  72.36,88.36 0 top
U4  45.09,77 0 top
U5  62.69,88.26 180 top
U6  72.89,38.57 90 top
U7  72.7,26 0 top
U8  61.87,68.1 270 top
U$3  22.3,21.4 90 bottom

### Tracks (layer width: path | path; a pad name or v marks a point on that pad's centre or on a via)
3.3V  (via drill 0.6)
  Top 0.305: U5.13 C5.1 v58.91,90.79 v58.9,90.8 | U5.8 63.44,90.94 64.1,91.6 C4.1 | C4.1 64.87,93.17 v64.9,93.2 | C4.1 | U3.13 v73.11,90.89 v73.1,90.9 | U3.2 69.64,88.61 C1.1 | U3.4 69.36,87.61 C1.1 | C1.1 v69,89.5
  Top 0.406: R3.2 v59,71.3 | R2.2 v59,77.6 | C8.1 U6.3 | U6.3 | U6.3 77.12,39.52 v77.2,39.6 | U8.3 C14.1 56.85,67.15 v56.8,67.1
  Route2 0.305: v64.9,93.2 64.9,93.3 | v58.9,90.8 58.8,90.9 | v73.1,90.9 73.1,91 | v69,89.5 69,89.6
  Route2 0.406: v59,71.3 59.2,71.3 | v59,77.6 59.2,77.6 | v77.2,39.6 77.4,39.6 | v56.8,67.1 56.7,67
  pour Route2: 88.17,0 2,0 arc-90 0,2 0,93.89 arc-90 2,95.89 88.17,95.89 arc-90 90.17,93.89 90.17,2 arc-90
5V
  Top 0.406: U7.5 C11.1
  Top 0.813: U7.4 78.16,29.5 C12.1
  pour Top: 88.17,0 2,0 arc-90 0,2 0,93.89 arc-90 2,95.89 88.17,95.89 arc-90 90.17,93.89 90.17,2 arc-90
BATT_INPUT
  Top 1.27: ST3.2 75.15,74.07 ST1.1 78.71,70.21 76.8,68.3 76.8,65.42 ST2.1
  Bottom 1.27: ST2.1 79.01,45.81 63,29.8 63,23.1 54.8,14.9 49.72,14.9 J1.PWR
ENAB_BURN1
  Top 0.406: R9.2 10.51,66.2 R8.1 20.39,66.27 U4.3
ENAB_BURN2  (via drill 0.6)
  Top 0.305: R13.1
  Top 0.406: R13.1 R14.2 | R13.1 v83.79,56.81 v83.8,56.8
  Route2 0.305: U4.4 38.39,80.81 51.1,68.1 51.1,67.5 51.7,66.9 54.8,66.9 61.5,60.2 80.4,60.2 v83.8,56.8
ENAB_BURN3  (via drill 0.6)
  Top 0.406: R20.2 26.56,8.74 R18.1 30.75,10.55 v31.1,10.2 | U4.5 17,57.8 17,55.7 11.4,50.1 v11.4,47
  Route2 0.406: v11.4,47 3.6,39.2 3.6,14.6 8,10.2 v31.1,10.2
ENAB_BURN4  (via drill 0.6)
  Top 0.305: v62.6,15.9 63.8,15.9 R25.2
  Top 0.406: R25.2 R24.1
  Route2 0.305: U4.6 38.37,75.73 v49.8,64.3
  Route15 0.305: v49.8,64.3 55.8,64.3 61.1,59 61.1,17.4 v62.6,15.9
ENAB_GPS
  Top 0.305: R21.1 25.4,81.1 36.5,92.2 38.6,92.2 48.3,82.5 48.3,75.06 U4.17/A3
  Top 0.406: R21.1 R22.2
GND  (via drill 0.6, 3.17 pad 5)
  Top 0.305: U5.18 59.61,87.01 | 59.61,87.01 C5.2 | C7.2 59.85,84.95 v58.9,85.9 59.61,86.61 59.61,87.01 | U5.1 v66.09,87.01 v66.1,87 | U5.11 61.94,90.76 v60.9,91.8 | C4.2 v68.49,91.59 v68.5,91.6 | U5.9 62.94,91.24 63.8,92.1 v63.8,94.1 C6.2 | U3.9 74.19,87.61 v75.2,86.6 | v75.4,91 v75.41,90.99 C2.2 74.11,88.61 U3.11 | C1.2 v69,85
  Top 0.406: C11.2 83.1,26 v84.5,27.4 | R15.2 v84.1,21.5 | U6.1 74.39,35.59 v73.8,35 | U8.1 60.37,70.17 v60.4,70.2 | T2.2 7.99,60.93 C9.2 5.96,61.04 v5.9,61.1 | R9.1 v5.1,66.2 | C13.2 76.73,59.32 T4.2 v74.7,56.8 | R14.1 83.7,53.3 v83.8,53.4 | T8.2 14.45,83.45 C16.2 v13.1,83.5 | R22.1 v18.3,85.1 | T6.2 28.87,15.93 C15.2 28.97,16.97 v29,17 | C8.2 77.27,41.13 v77.3,41.1 | R1.1 62.9,20.7 v63.6,20 | T10.2 65.95,8.85 C17.2 | C17.2 65.9,8 v66.5,7.4 | C17.2 64.8,8.9 64.2,9.5 64.2,11.6 64.7,12.1 R25.1 | C14.2 60.35,65.35 v60.4,65.3 | R20.1 24.8,6.2 v25.2,5.8 | R5.1 C18.2 v58.4,57.7
  Top 0.61: U1.GND3 20.62,18.82 | C10.2 v66.5,37.2 | JP8.1 5.4,78.5 v5.7,78.8
  Top 0.813: C12.2 v84.5,27.4 | U7.7 v72.7,17.8 | U7.3 73.84,34.96 v73.8,35 | U1.GND1 32.62,56.38 v32.6,56.4 | U1.GND2 18.62,56.38 v18.6,56.4 | 20.62,18.82 v20.6,18.8
  Bottom 0.305: v58.9,85.9 59,86 | v66.1,87 66.2,87 | v60.9,91.8 60.8,91.8 | v68.5,91.6 68.5,91.8 | v63.8,94.1 63.8,94.2 | v75.2,86.6 75.2,86.4 | v75.4,91 75.4,91.1 75.3,91.2 | v69,85 69,84.9 68.9,84.8
  Bottom 0.406: v84.1,21.5 84.3,21.5 | v60.4,70.2 60.4,70.4 60.6,70.6 | v60.4,65.3 60.4,64.9 | v5.9,61.1 5.9,61.2 5.8,61.3 | v5.1,66.2 5,66.3 | v83.8,53.4 83.8,53.5 84,53.7 | v74.7,56.8 74.6,56.8 74.5,56.9 | v18.3,85.1 18.4,85.1 18.6,85.3 | v13.1,83.5 12.9,83.5 12.7,83.7 | v29,17 29.2,17 | v77.3,41.1 77.4,41.1 | v63.6,20 63.7,20 63.8,19.9 | v66.5,7.4 66.6,7.2 | v25.2,5.8 25.5,5.8 | v58.4,57.7 58.4,57.4
  Bottom 0.61: v66.5,37.2 66.6,37.3 | v5.7,78.8 5.9,78.8 6.3,79.2
  Bottom 0.813: v84.5,27.4 84.5,27.2 | v72.7,17.8 72.7,17.6 | v73.8,35 73.8,35.2 | v32.6,56.4 32.6,56.6 | v18.6,56.4 18.6,56.5 | v20.6,18.8 20.6,18.3 20.7,18.2
  other vias: 8.89,90.81 82.55,90.81 85.09,5.08 5.09,5.08
  pour Bottom: 2,95.89 88.17,95.89 arc-90 90.17,93.89 90.17,2 arc-90 88.17,0 2,0 arc-90 0,2 0,93.89 arc-90
GPS_PWR
  Top 0.813: T7.8 T7.7 | T7.6 T7.5 6.6,70 JP8.5
  Top 1.016: T7.7 T7.6
I2C_SCL  (via drill 0.6)
  Top 0.305: R2.1 58.8,75.8 63.44,80.44 63.44,82.3 | U5.23 63.44,82.3 | U3.1 69.6,90.5 67.6,90.5 66.6,89.5 v66.6,89.1 | v62,82.3 63.44,82.3
  Top 0.406: U4.19/A5 57.53,75.73 R2.1
  Route2 0.305: v66.6,89.1 62,84.5 v62,82.3
I2C_SDA  (via drill 0.6)
  Top 0.305: 57.51,73.19 63.94,79.62 63.94,83.5 | 63.94,83.5 U5.24 | U3.16 70.9,90.44 v70.9,91.5 | v65.3,83.6 64.04,83.6 63.94,83.5
  Top 0.406: U4.18/A4 57.51,73.19 R3.1
  Route2 0.305: v70.9,91.5 70.9,89.2 v65.3,83.6
I_BATT  (via drill 0.6)
  Top 0.406: U6.2 75.83,38.57 v76.7,37.7
  Route2 0.406: 76.6,37.6 v76.7,37.7 74.8,39.6 74.8,44.2 55.97,63.03 U4.14/A0
I_SOLAR
  Top 0.406: U4.16/A2 U8.2
N$1
  Top 1.27: ST2.2 79.37,67.07 81.4,69.1 81.4,71.68 ST1.2 ST5.1
  Bottom 1.27: J1.GND 52.46,10.29 J1.GNDBREAK 61,10.7 81.9,31.6 81.9,64.54 79.37,67.07 ST2.2
N$2
  Top 0.406: C13.1 T4.1 R13.2
N$3
  Top 0.406: R12.1 T4.3 77.7,54.08 77.7,49 76.75,48.05 T3.4
N$4
  Top 1.27: ST3.1 ST4.2
N$5
  Top 0.406: C15.1 T6.1 R18.2
N$6
  Top 0.406: T5.4 T6.3 R17.1
N$7
  Top 0.406: 78.4,21.43 U7.6 81.2,21.43 R15.1
N$8
  Top 0.406: C17.1 65.95,10.75 T10.1 R24.2
N$9
  Top 0.406: T9.4 T10.3 R23.1
N$10
  Top 0.406: C16.1 16.35,83.45 T8.1 R21.2
N$11  (via drill 0.6)
  Top 0.305: v44.8,2 S1.3
  Route15 0.305: U4.23/A9 51.41,84.6 45.5,84.6 41.3,80.4 41.3,5.5 v44.8,2
N$12
  Top 0.406: R19.1 T8.3 T7.4
N$13  (via drill 0.6)
  Top 0.305: v35.6,2 S1.6
  Route15 0.305: U4.VUSB 38.8,79.61 38.8,5.2 v35.6,2
N$14
  cutout Route2: 74.1,90.1 70.6,90.1 70.6,86.6 74.1,86.6
N$15
  cutout Route15: 74.1,90.1 74.1,86.6 70.6,86.6 70.6,90.1
N$16
  cutout Bottom: 74.1,90.1 74.1,86.6 70.6,86.6 70.6,90.1
N$19
  Top 0.813: SMA1.1 18.58,21.5 U1.ANT
N$21
  Top 0.406: R8.2 T2.1 C9.1
N$24
  Top 0.406: T1.4 T2.3 R6.1
N$37
  Top 0.406: U4.15/A1 53.23,65.57 R4.1 R5.2 C18.1
N$39
  Top 0.305: U5.20 C7.1
N$40
  Top 0.305: U5.10 C6.1
N$42
  Top 0.305: U3.10 C2.1
N$43
  Top 0.305: C3.1 77.53,87.03 75.9,85.4 73.9,85.4 73.1,86.2 U3.8
N$44
  Top 0.305: U3.12 73.73,90.23 74.2,90.7 74.2,91.6 74.5,91.9 76.9,91.9 77.5,91.3 77.5,89.14 C3.2
N_ENAB_REG
  Top 0.406: U7.1 R1.2 61.06,27.84 U2.15
PGM_RST  (via drill 0.6)
  Top 0.305: U2.22 v57.2,44.2 | S1.2 44.7,6.08 v44.7,14.9
  Route15 0.305: v57.2,44.2 57.2,21.2 53.1,17.1 46.9,17.1 v44.7,14.9
PGM_VCC  (via drill 0.6)
  Top 0.305: v35.6,4.5 S1.5
  Route2 0.305: U2.21 57.2,41.66 57.2,26.1 v35.6,4.5
RF_NIRQ  (via drill 0.6)
  Top 0.406: U1.NIRQ 22.62,56.48 v22.6,56.5
  Route2 0.406: v22.6,56.5 22.6,71.03 U4.2
RF_SDN
  Top 0.406: U1.SDN 20.62,58.02 30.7,68.1 37.45,68.1 U4.9
SPI_MISO
  Top 0.406: U1.SDO 30.62,56.52 34.6,60.5 37.45,60.5 U4.12
SPI_MOSI
  Top 0.406: U1.SDI 28.62,58.32 33.3,63 37.44,63 U4.11
SPI_SCK  (via drill 0.6)
  Top 0.406: U1.SCK 26.62,56.48 v26.6,56.5
  Route2 0.406: v26.6,56.5 28.4,58.3 50.52,58.3 U4.13
SPI_SS
  Top 0.406: U1.NSEL 24.62,59.02 31.2,65.6 37.44,65.6 U4.10
UART1_RX
  Top 0.305: U2.1 41.3,52.78 41.3,87.14 U4.0
UART1_TX
  Top 0.305: U2.2 38.8,52.74 38.8,87.09 U4.1
UART3_RX  (via drill 0.6)
  Top 0.406: v8.1,73.2 7.6,73.7 JP8.3
  Route15 0.406: U4.7 v8.11,73.19 v8.1,73.2
UART3_TX  (via drill 0.6)
  Top 0.406: v10,71.7 10,73.2 8.3,74.9 5.45,74.9 JP8.2
  Route15 0.406: U4.8 36.41,71.7 v10,71.7
VBATT
  Top 0.406: 65.08,69.05 R16.1 | R7.2 71.35,39.48 U6.4 | R4.2 57.39,63.21 ST4.1 66.03,69.05 65.08,69.05 | 65.08,69.05 U8.5
  Top 0.813: 69.2,41.4 69.2,39.5 R7.2
  Top 1.27: U2.24 59.9,50.7 69.2,41.4 | R10.2 R11.2 68.48,59.82 ST4.1
  Bottom 1.27: ST4.1 59.36,50.7 U2.24
VBURN1
  Top 0.813: T1.5 T1.6 T1.7 T1.8 8,49.38 JP1.3
VBURN2
  Top 0.813: T3.8 T3.7 | T3.7 T3.6 T3.5 | JP2.3 80.4,50.48 T3.7
VBURN3
  Top 0.813: T5.5 T5.6 T5.7 T5.8 20.28,6.47 JP3.3
VBURN4
  Top 0.813: T9.8 T9.7 T9.6 T9.5 78.4,4.65 JP7.3
VBURN_IN  (via drill 0.6)
  Top 0.406: T1.3 15.28,57.98 17.1,59.8 17.1,61.85 R6.2 | T3.1 73.67,53.28 R12.2 | R17.2 21.41,10.55 T5.1 | R23.2 72.81,14 T9.1
  Top 0.813: T1.1 13.2,56.1 | 13.2,56.1 T1.2 T1.3 | T3.2 T3.3 | T5.3 T5.2 T5.1 20.78,10.22 v23.1,7.9 | T9.3 T9.2 T9.1 70.61,16.2 65.1,16.2 61.5,19.8 v37.1,19.8 | v15.6,56.1 13.2,56.1 | T3.2 67.55,50.59 R10.1 | T3.1 T3.2
  Top 1.27: R11.1 R10.1 53.65,55.95 v53.6,56
  Bottom 1.27: v53.6,56 36.4,56 | 36.4,56 34.1,58.3 17.8,58.3 v15.6,56.1 | v23.1,7.9 25.2,7.9 v37.1,19.8 37.1,55.3 36.4,56
VREG_IN
  Top 0.406: U6.5 69.28,37.62 R7.1
  Top 0.813: U7.2 69.3,31.46 C10.1 69.28,35.12 69.28,35.62 69.22,35.68 R7.1
VSOLAR  (via drill 0.6)
  Top 0.406: U8.4 65.12,67.15 R16.2
  Top 0.61: U8.4 63.37,65.23 v63.4,65.2
  Route15 0.61: v63.4,65.2 63.6,65
  pour Route15: 0,2 0,93.89 arc-90 2,95.89 88.17,95.89 arc-90 90.17,93.89 90.17,2 arc-90 88.17,0 2,0 arc-90

### Text on the board
tPlace: FLIGHT | PROG
tNames: Teensy 3.1 | Solar Panel | Batteries | Solar Panel | Solar Panel | Solar Panel | Burner | Solar Panel
bNames: Foot Switches | Solar Panel
tValues: Rail Switch | - | + | - | +
200bmp: Main Board V1.2